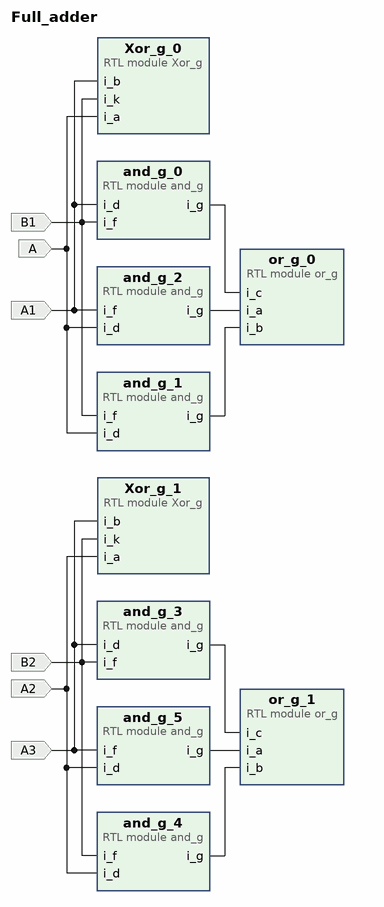
[diagram p0: block diagram of the top level]
# Vivado block design Full_adder, xc7a35tcpg236-1, Vivado 2023.1
create_bd_design Full_adder

create_bd_port -dir I A
create_bd_port -dir I A1
create_bd_port -dir I B1
create_bd_port -dir I A2
create_bd_port -dir I A3
create_bd_port -dir I B2

create_bd_cell -type module -reference and_g and_g_0
create_bd_cell -type module -reference Xor_g Xor_g_0
create_bd_cell -type module -reference and_g and_g_1
create_bd_cell -type module -reference and_g and_g_2
create_bd_cell -type module -reference or_g or_g_0
create_bd_cell -type module -reference Xor_g Xor_g_1
create_bd_cell -type module -reference and_g and_g_3
create_bd_cell -type module -reference and_g and_g_4
create_bd_cell -type module -reference and_g and_g_5
create_bd_cell -type module -reference or_g or_g_1

# ---- connections ----

connect_bd_net -net A1_1 [get_bd_ports A1] [get_bd_pins Xor_g_0/i_b] [get_bd_pins and_g_2/i_f] [get_bd_pins and_g_0/i_d]
connect_bd_net -net A1_2 [get_bd_ports A3] [get_bd_pins Xor_g_1/i_b] [get_bd_pins and_g_5/i_f] [get_bd_pins and_g_3/i_d]
connect_bd_net -net B1_1 [get_bd_ports B1] [get_bd_pins Xor_g_0/i_k] [get_bd_pins and_g_1/i_f] [get_bd_pins and_g_0/i_f]
connect_bd_net -net B1_2 [get_bd_ports B2] [get_bd_pins Xor_g_1/i_k] [get_bd_pins and_g_4/i_f] [get_bd_pins and_g_3/i_f]
connect_bd_net [get_bd_ports A] [get_bd_pins and_g_1/i_d] [get_bd_pins and_g_2/i_d] [get_bd_pins Xor_g_0/i_a]
connect_bd_net [get_bd_ports A2] [get_bd_pins and_g_4/i_d] [get_bd_pins and_g_5/i_d] [get_bd_pins Xor_g_1/i_a]
connect_bd_net [get_bd_pins and_g_0/i_g] [get_bd_pins or_g_0/i_c]
connect_bd_net -net and_g_0_i_g1 [get_bd_pins and_g_3/i_g] [get_bd_pins or_g_1/i_c]
connect_bd_net [get_bd_pins and_g_1/i_g] [get_bd_pins or_g_0/i_b]
connect_bd_net -net and_g_1_i_g1 [get_bd_pins and_g_4/i_g] [get_bd_pins or_g_1/i_b]
connect_bd_net [get_bd_pins and_g_2/i_g] [get_bd_pins or_g_0/i_a]
connect_bd_net -net and_g_2_i_g1 [get_bd_pins and_g_5/i_g] [get_bd_pins or_g_1/i_a]

validate_bd_design
save_bd_design
